# Altium schematic sheet Connectors.SchDoc
size A4; SheetNumber: 1; SheetTotal: 2
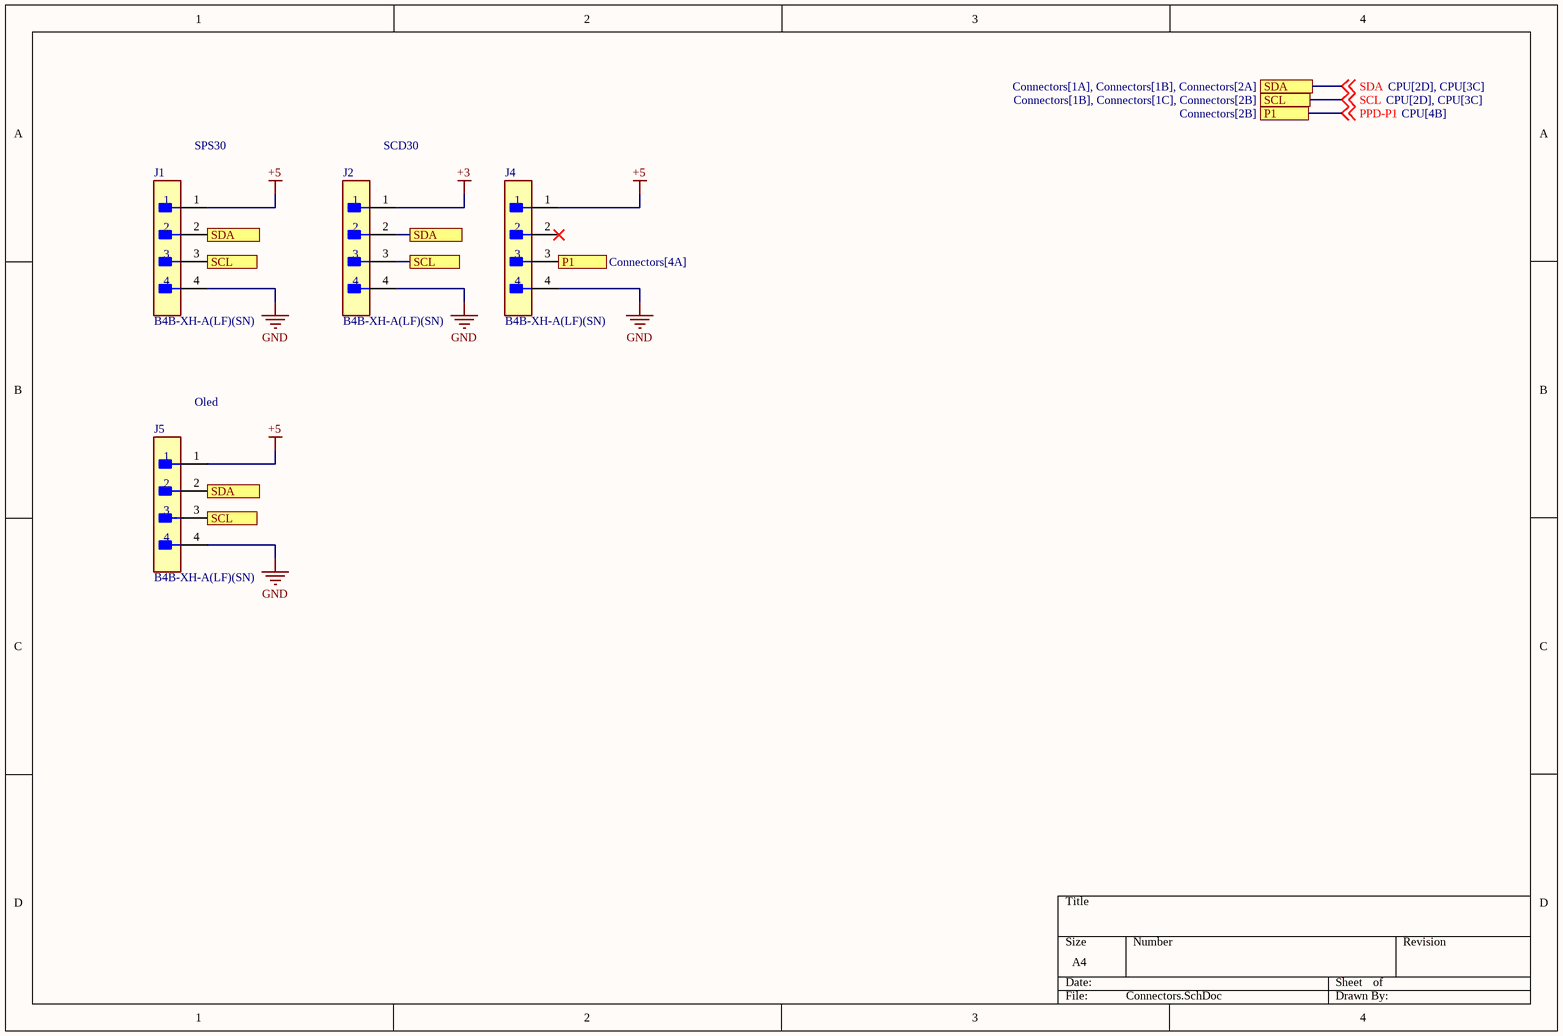
[diagram p0: Connectors.SchDoc]

## Parts
J1  B4B-XH-A(LF)(SN)  [FP-B4B-XH-A_LF_SN-MFG]
J2  B4B-XH-A(LF)(SN)  [FP-B4B-XH-A_LF_SN-MFG]
J4  B4B-XH-A(LF)(SN)  [FP-B4B-XH-A_LF_SN-MFG]
J5  B4B-XH-A(LF)(SN)  [FP-B4B-XH-A_LF_SN-MFG]

## Ports
P1 (see Connectors[2B]), P1 (see Connectors[4A]), SCL (see Connectors[1B], Connectors[1C], Connectors[2B]), SCL (see Connectors[1B], Connectors[1C], Connectors[4A]), SCL (see Connectors[1B], Connectors[2B], Connectors[4A]), SCL (see Connectors[1C], Connectors[2B], Connectors[4A]), SDA (see Connectors[1A], Connectors[1B], Connectors[2A]), SDA (see Connectors[1A], Connectors[1B], Connectors[4A]), SDA (see Connectors[1A], Connectors[2A], Connectors[4A]), SDA (see Connectors[1B], Connectors[2A], Connectors[4A])

## Nets
+3: J2.1
+5: J1.1 J4.1 J5.1
GND: J1.4 J2.4 J4.4 J5.4
PPD-P1: J4.3 ; off-sheet PPD-P1, port P1
SCL: J1.3 J2.3 J5.3 ; off-sheet SCL, port SCL
SDA: J1.2 J2.2 J5.2 ; off-sheet SDA, port SDA

Not connected (* = marked no-connect by the designer): J4 2*

## Notes on the sheet
- SPS30
- SCD30
- Oled

## Library data of the parts
J1 J2 J4 J5 = CMP-17439-000250-1: CONN HEADER VERT 4POS 2.5MM; Number of Contacts: 4; Contact Resistance: 20mR; Voltage Rating: 250V; Max Current Rating: 3A; Gender: Male; Wire/Cable Gauge: 22AWG; Mated Stacking Heights: 9.8mm; Insulation Resistance: 1GR; Orientation: Straight; Contact Type: Male Pin; Contact Finish - Mating: TIN; Series: XH; Max Voltage Rating (AC): 250V; Lead Pitch: 2.5mm; Contact Shape: Square; Insulation Color: Natural; Termination: Solder; Lead Free: Lead Free; Voltage Rating (AC): 250V; Number of Rows: 1; Flammability Rating: UL94 V-0; Number of Positions: 4; Max Operating Temperature: 85°C; Package Quantity: 500; Mount: Through Hole; REACH SVHC: No SVHC; Connector Type: Header; Insulation Material: Nylon; Fastening Type: Detent; Min Operating Temperature: -25°C; Housing Color: White; Packaging: Bulk; Contact Plating: Tin; Contact Material: Brass; Max Voltage Rating (DC): 250V; Housing Material: Polyamide; Color: Natural; Material: Polyamide; Pitch: 2.5mm; Depth: 5.75mm; Current Rating: 3A; Length: 12.4mm